# Altium project DC_Driver_Devboard.PrjPcb
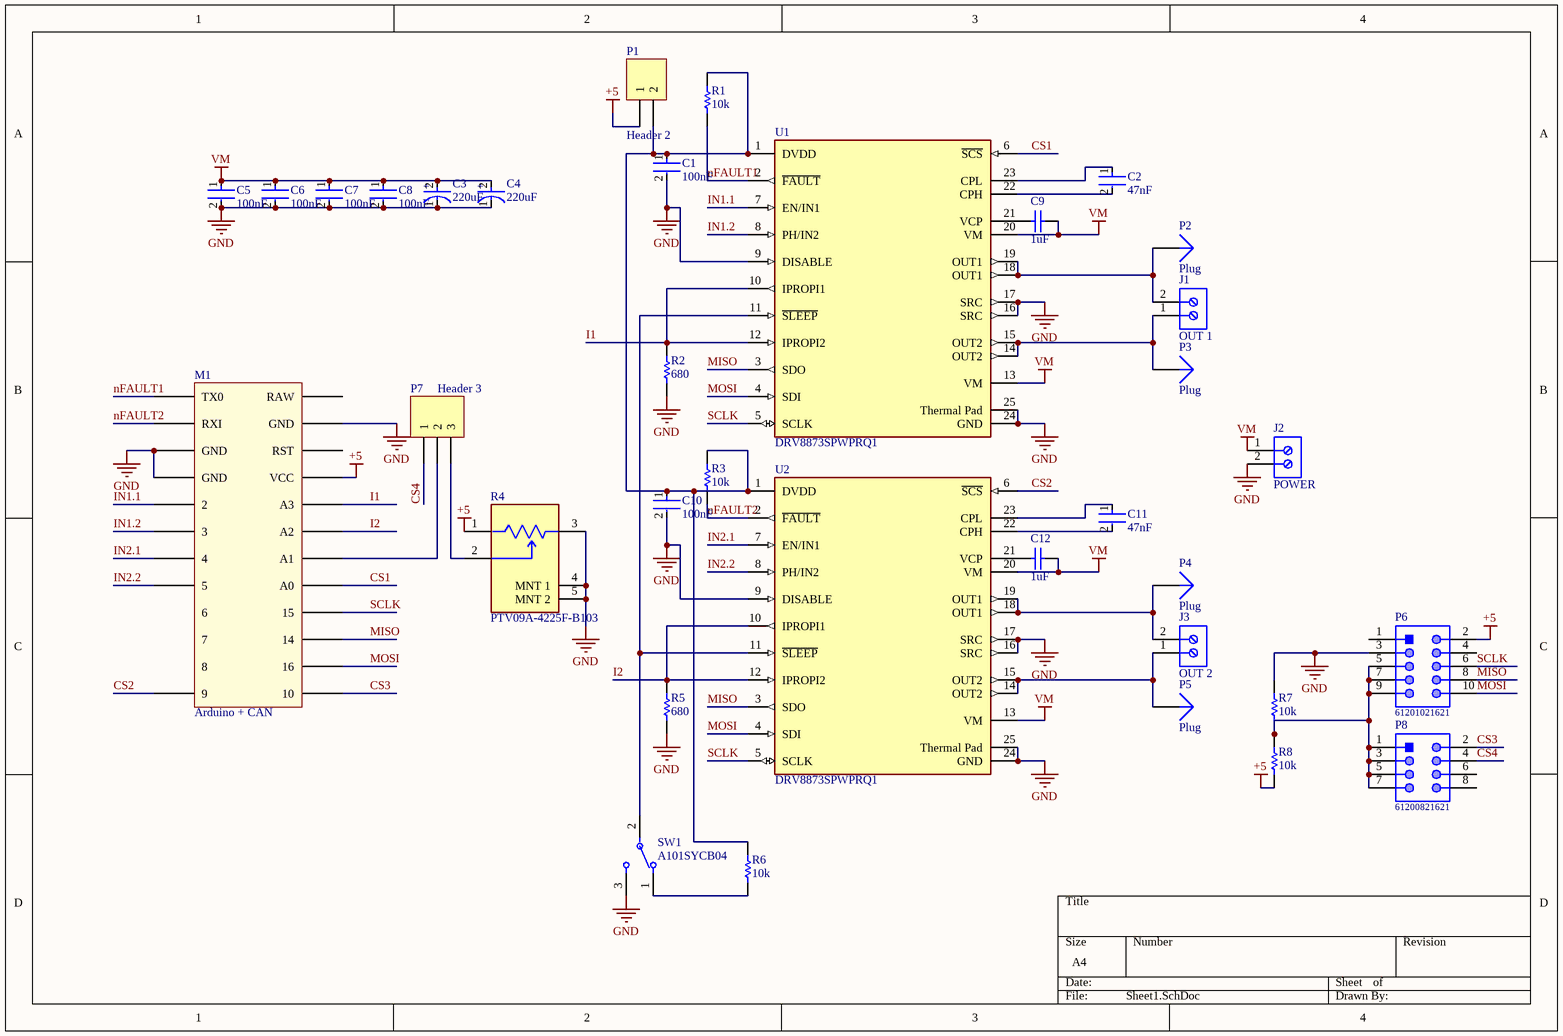
[diagram p0: Sheet1.SchDoc]
1 sheet, 35 parts. Net scope: global (net labels, ports and power ports of the same name join across sheets).
Board file: PCB1.PcbDoc

## Sheet Sheet1.SchDoc
size A4; SheetNumber: 1; SheetTotal: 1

### Parts
C1  100nF  [FP-0805-L_2_01_0_2-W_1_25-IPC_B]
C2  47nF  [FP-C0805C-DN-MFG]
C3  220uF  [FP-UWT1V221MNL1GS-MFG]
C4  220uF  [FP-UWT1V221MNL1GS-MFG]
C5  100nF  [FP-0805-L_2_01_0_2-W_1_25-IPC_B]
C6  100nF  [FP-0805-L_2_01_0_2-W_1_25-IPC_B]
C7  100nF  [FP-0805-L_2_01_0_2-W_1_25-IPC_B]
C8  100nF  [FP-0805-L_2_01_0_2-W_1_25-IPC_B]
C9  1uF  [CAPC2013X145X50LL20T25]
C10  100nF  [FP-0805-L_2_01_0_2-W_1_25-IPC_B]
C11  47nF  [FP-C0805C-DN-MFG]
C12  1uF  [CAPC2013X145X50LL20T25]
J1  OUT 1  [691102710002]
J2  POWER  [691102710002]
J3  OUT 2  [691102710002]
M1  Arduino + CAN  [PCBComponent_1]
P1  Header 2  [HDR1X2]
P2  Plug  [PIN1]
P3  Plug  [PIN1]
P4  Plug  [PIN1]
P5  Plug  [PIN1]
P6  61201021621  [61201021621]
P7  Header 3  [HDR1X3]
P8  61200821621  [61200821621]
R1  10k  [RESC2013X60X35NL10T20]
R2  680  [RESC2013X60X35NL10T20]
R3  10k  [RESC2013X60X35NL10T20]
R4  PTV09A-4225F-B103  [FP-PTV09A-4-MFG]
R5  680  [RESC2013X60X35NL10T20]
R6  10k  [RESC2013X60X35NL10T20]
R7  10k  [RESC2013X60X35NL10T20]
R8  10k  [RESC2013X60X35NL10T20]
SW1  A101SYCB04  [FP-A101SYCB04-MFG]
U1  DRV8873SPWPRQ1  [FP-PWP0024J-MFG]
U2  DRV8873SPWPRQ1  [FP-PWP0024J-MFG]

### Nets
+5: M1.21(VCC) P1.1 P6.2 R4.1 R8.1
GND: C1.2 C3.1(C) C4.1(C) C5.2 C6.2 C7.2 C8.2 C10.2 J2.2 M1.3(GND) M1.4(GND) M1.23(GND) P6.3 R2.1 R4.3 R4.4(MNT_1) R4.5(MNT_2) R5.1 R7.2 SW1.3 U1.9(DISABLE) U1.16(SRC) U1.17(SRC) U1.24(GND) U1.25(Thermal_Pad) U2.9(DISABLE) U2.16(SRC) U2.17(SRC) U2.24(GND) U2.25(Thermal_Pad)
VM: C3.2(A) C4.2(A) C5.1 C6.1 C7.1 C8.1 C9.2 C12.2 J2.1 U1.13(VM) U1.20(VM) U2.13(VM) U2.20(VM)
CS1: M1.17(A0) U1.6(~{SCS})
CS2: M1.12(9) U2.6(~{SCS})
CS3: M1.13(10) P8.2
CS4: P7.1 P8.4
I1: M1.20(A3) R2.2 U1.10(IPROPI1) U1.12(IPROPI2)
I2: M1.19(A2) R5.2 U2.10(IPROPI1) U2.12(IPROPI2)
IN1.1: M1.5(2) U1.7(EN/IN1)
IN1.2: M1.6(3) U1.8(PH/IN2)
IN2.1: M1.7(4) U2.7(EN/IN1)
IN2.2: M1.8(5) U2.8(PH/IN2)
MISO: M1.15(14) P6.8 U1.3(SDO) U2.3(SDO)
MOSI: M1.14(16) P6.10 U1.4(SDI) U2.4(SDI)
nFAULT1: M1.1(TX0) R1.1 U1.2(~{FAULT})
nFAULT2: M1.2(RXI) R3.1 U2.2(~{FAULT})
SCLK: M1.16(15) P6.6 U1.5(SCLK) U2.5(SCLK)
NetC1_1: C1.1 C10.1 P1.2 R1.2 R3.2 R6.2 U1.1(DVDD) U2.1(DVDD)
NetC2_1: C2.1 U1.23(CPL)
NetC2_2: C2.2 U1.22(CPH)
NetC9_1: C9.1 U1.21(VCP)
NetC11_1: C11.1 U2.23(CPL)
NetC11_2: C11.2 U2.22(CPH)
NetC12_1: C12.1 U2.21(VCP)
NetJ1_1: J1.1 P3.1 U1.14(OUT2) U1.15(OUT2)
NetJ1_2: J1.2 P2.1 U1.18(OUT1) U1.19(OUT1)
NetJ3_1: J3.1 P5.1 U2.14(OUT2) U2.15(OUT2)
NetJ3_2: J3.2 P4.1 U2.18(OUT1) U2.19(OUT1)
NetM1_18: M1.18(A1) P7.2
NetP6_5: P6.5 P6.7 P6.9 P8.1 P8.3 P8.5 P8.7 R7.1 R8.2
NetP7_3: P7.3 R4.2
NetR6_1: R6.1 SW1.1
NetSW1_2: SW1.2 U1.11(~{SLEEP}) U2.11(~{SLEEP})

Not connected (* = marked no-connect by the designer): M1 9(6) 10(7) 11(8) 22(RST) 24(RAW); P6 1 4; P8 6 8

### Notes on the sheet
- (in symbol CMP-12462-000057-1) +

### Library data of the parts
C1 C5-C8 C10 = CMP-2007-04174-2: General Purpose Ceramic Capacitor, 0805, 100nF, 10%, X7R, 15%, 100V; Packaging: Tape and Reel; Min Operating Temperature: -55°C; Dielectric Material: Ceramic; Height: 1.4mm; Voltage Rating: 100V; Termination: SMD/SMT; Case Code (Imperial): 0805; Case Code (Metric): 2012; Case/Package: 0805; Construction: Flat; Radiation Hardening: No; Series: -; Dielectric: X7R; Package Quantity: 2000; Mount: Surface Mount; Capacitance: 100nF; Contact Plating: Tin; Voltage: 100V; Lead Free: Lead Free; Depth: 1.25mm; RoHS Compliant: Yes; Number of Pins: 2; Max Operating Temperature: 125°C; Length: 2.01mm; Voltage Rating (DC): 100V; Thickness: 0.055inch; REACH SVHC: No SVHC; Width: 0.049inch; Tolerance: 10%
C2 C11 = CMP-2007-01098-2: CAP CER 0.047UF 50V X7R 0805; Manufacturer Part Number: C0805C473K5RACTU; Manufacturer: KEMET; Value: 47,000 pF; Material: Ceramic; Tolerance: 0.1; Temperature Coefficient: 30ppm/°C; Ipc Land Pattern Name: CAPC200125X78; ComponentLink2URL: https://content.kemet.com/datasheets/KEM_C1003_C0G_SMD.pdf; ComponentLink2Description: Datasheet; Voltage Rating: 50 V; Device Class L3: Ceramic Capacitors; Temperature Range High: +125°C; Temperature: -55°C to +125°C; RoHS: TRUE; Capacitance: 47,000 pF; Digikey Description: CAP CER 0.047UF 50V X7R 0805; Octopart: https://octopart.com/c0805c473k5ractu-kemet-138387; Temperature Range Low: -55°C; Height: 0.88mm; Lead Free: Yes; Temperature Characteristic: X7R; Mouser Description: Capacitor; Ceramic; Cap 0.047 uF; Tol 10%; Vol-Rtg 50 VDC; SMT; 0805; X7R; Tape&Reel; Automotive: No; Device Class L1: Passive Components; Device Class L2: Capacitors; Package: C0805C-DN; Category: Cap
C3 C4 = CMP-12462-000057-1: CAP ALUM 220UF 20% 35V SMD; Dielectric Material: Aluminium; Ripple Current: 190mA; Leakage Current: 3uA; Lead Diameter: 1.1mm; Dissipation Factor: 0.14%; Life (Hours): 1000Hour; Lead Pitch: 0.327inch; Radiation Hardening: No; Termination: SMD/SMT; Min Operating Temperature: -55°C; Construction: Cylindrical; Voltage Rating (DC): 35V; Capacitance: 220uF; Package Quantity: 500; Voltage Rating: 35V; RoHS Compliant: Yes; Height - Seated (Max): 0.394inch; Length: 10mm; Lead Free: Lead Free; Voltage: 35V; Diameter: 8mm; Max Operating Temperature: 105°C; Height: 10mm; REACH SVHC: No SVHC; Number of Pins: 2; Mount: Surface Mount; Case/Package: Radial; Packaging: Tape and Reel; Tolerance: 20%; Ripple Current (AC): 190mA; Series: WT
C9 C12 = CMP-1036-04746-2: Manufacturer: Kemet; Part Number: C0805C105K4PACTU
J1-J3 = CMP-1502-03258-2: NexarPartId: 8917706; Number of Levels: 1; Number of Positions Per Level: 2; Current: 15A; Voltage: 300V; Pitch: 5.0038mm; Plating: Steel; Stripping Length: -6mm; Wire Gauge (Min): 14AWG; Wire Gauge (Max): 22AWG; Length: 7.5mm; Contact Material: Brass; Contact Plating: Tin; Packaging: Box; Number of Pins: 2; Voltage Rating: 300V; Termination: Screw; Number of Contacts: 2; Color: Blue; Current Rating: 15A; Mount: Through Hole; Max Operating Temperature: 105°C; Min Operating Temperature: -40°C; REACH SVHC: Unknown; Height: 13.4mm; Width: 11.2mm; Housing Material: Nylon; RoHS: Compliant; Wire/Cable Gauge: 22AWG; Lead Pitch: 5mm
M1 = Arduino: Arduino Pro Micro + CAN Shield
P1 = Header 2: Header, 2-Pin; LatestRevisionDate: 17-Jul-2002; LatestRevisionNote: Re-released for DXP Platform.; Publisher: Altium Limited
P6 = CMP-1502-00007-1: Male Box Header WR-BHD, THT, Vertical, pitch 2.54 mm, 10 pins; Manufacturer: Wurth Elektronik; Contact Resistance: 20mOhm; Withstanding Voltage: 500VAC; Pin Number: 10; Working Voltage: 250VAC; Pitch: 2.54mm; Mounting Technology: THT; Operating Temperature: -40to125degC; Published Date: August2018; Gender: Male; Packaging: Tray; Manufacturer URL: http://www.we-online.de; Datasheet URL: https://katalog.we-online.de/em/datasheet/6120xx21621.pdf; Orientation: Vertical; Package Reference: 61201021621; Part Number: 61201021621; Publisher: WurthElektronik
P7 = Header 3: Header, 3-Pin; LatestRevisionDate: 17-Jul-2002; LatestRevisionNote: Re-released for DXP Platform.; Publisher: Altium Limited
P8 = CMP-1502-00006-1: Male Box Header WR-BHD, THT, Vertical, pitch 2.54 mm, 8 pins; Manufacturer: Wurth Elektronik; Working Voltage: 250VAC; Withstanding Voltage: 500VAC; Contact Resistance: 20mOhm; Pitch: 2.54mm; Pin Number: 8; Datasheet URL: https://katalog.we-online.de/em/datasheet/6120xx21621.pdf; Mounting Technology: THT; Publisher: WurthElektronik; Orientation: Vertical; Part Number: 61200821621; Operating Temperature: -40to125degC; Gender: Male; Packaging: Tray; Published Date: August2018; Package Reference: 61200821621; Manufacturer URL: http://www.we-online.de
R1-R3 R5-R8 = CMP-1659-00013-4: Chip Resistor, 10 KOhm, +/- 1%, 0.125 W, -55 to 155 degC, 0805 (2012 Metric), RoHS, Tape and Reel; Manufacturer: Yageo; Voltage Rating: 150 V; Mount: Surface Mount; ComponentLink1Description: Manufacturer URL; ComponentLink2URL: http://www.yageo.com/documents/recent/PYu-RC_Group_51_RoHS_L_04.pdf; Pins: 2; Length: 2 mm; Min Operating Temperature: -55 degC; Height: 0.5 mm; Mounting Technology: Surface Mount; RoHSCompliant: true; REACH SVHC: No SVHC; ComponentLink1URL: http://www.yageo.com/; Max Operating Temperature: 155 degC; PackageReference: 0805; DatasheetVersion: Rev. 4, 02/2016; Package Quantity: 5000; Packaging: Tape and Reel; ComponentLink2Description: Datasheet; PackageDescription: 2-Pin Surface Mounted Device, Body 2 x 1.25 mm
R4 = CMP-07234-000052-1: POT 10K OHM 1/20W CARBON LINEAR; Power Rating: 50mW; Number of Gangs: 1; Hole Diameter: 9.1mm; Actuator Diameter: 0.236inch; Resistance Tolerance: 20%; Resistance: 10kR; Actuator Length: 0.984inch; Min Operating Temperature: -10°C; RoHS Compliant: Yes; Technology: CARBON FILM; Radiation Hardening: No; Taper: Linear; Military Standard: Not; Type: Potentiometer; Mount: Through Hole; Length: 11.4mm; Tolerance: 20%; Max Power Dissipation: 50mW; Max Operating Temperature: 50°C; Package Quantity: 100; Termination: PCB; Packaging: Bulk; Depth: 12.5mm; Resistor Type: Carbon; Number of Turns: 1; Series: Pro Audio PTV09; Height: 12.5mm; REACH SVHC: No SVHC
SW1 = CMP-03408-000017-1: SWITCH TOGGLE SPDT 0.4VA 20V; Electrical Life: 6000Cycles; Number of Poles: 1; Power Rating: 400mW; Switch Function: On-On; Contact Resistance: 10mR; Contact Current Rating: 400mA; Actuator Material: Phenolic; Insulation Resistance: 30MR; Actuator Color: Chrome; Number of Positions: 2; Actuator Type: Standard Round; Actuator Length: 10.41mm; Illumination Type: Non-Illuminated; Flammability Rating: UL94 V-1; Contact Material: Copper; Depth: 6.86mm; Contact Plating: Gold; Voltage Rating (AC): 20V; Max Voltage Rating (DC): 20V; Min Operating Temperature: -30°C; Max Operating Temperature: 85°C; Throw Configuration: SPDT; Packaging: Bulk; Termination: PC Pins; Series: Gemini A; ELV: Compliant; Lead Free: Lead Free; RoHS Compliant: Yes; REACH SVHC: No SVHC; Mount: Panel; Orientation: Straight; Package Quantity: 100; Max Voltage Rating (AC): 20V; Radiation Hardening: No; Voltage Rating (DC): 20V
U1 U2 = CMP-04915-000063-1: IC MTRDRV UNIPLR 0-5.5V 24HTSSOP; Logic Function: AND GATE; Output Current: 10mA; Interface: SPI; RoHS Compliant: Yes; Min Operating Temperature: -40°C; Packaging: Cut Tape; Mount: Surface Mount; Max Operating Temperature: 125°C
P2-P5 = Plug: LatestRevisionDate: 17-Jul-2002; LatestRevisionNote: Re-released for DXP Platform.; Publisher: Altium Limited